# EAGLE design NZN Breakout (EAGLE 7.5.0)
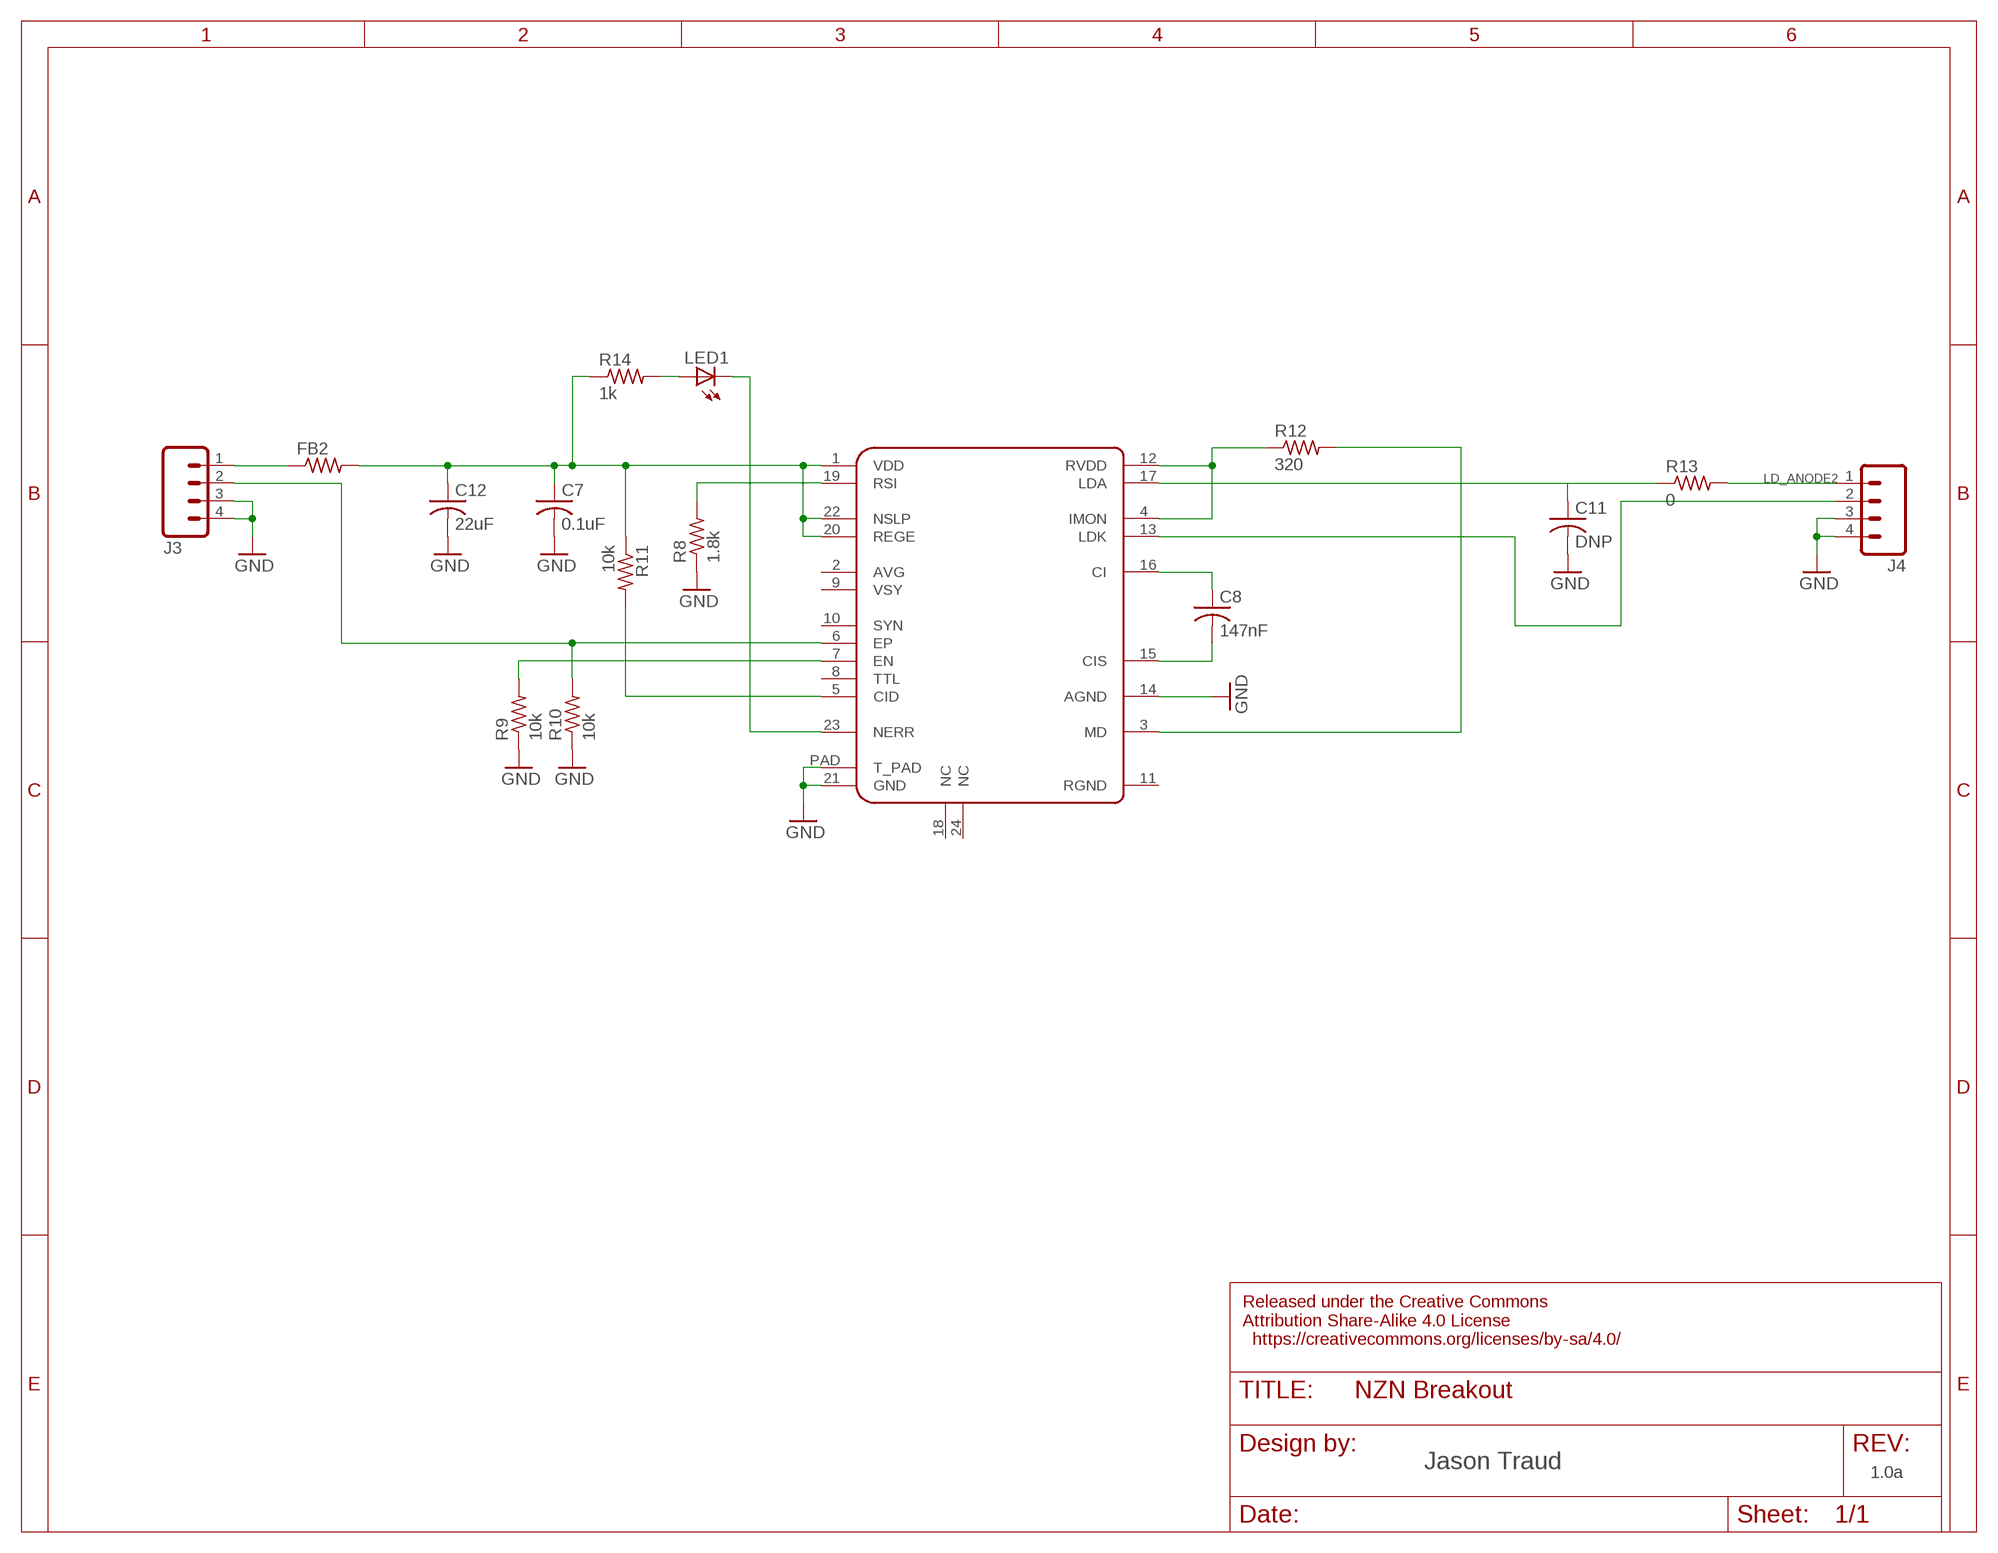
[diagram p0: schematic, sheet 1]

## Parts
C7  0.1uF  C-USC0402  [C0402]
C8  147nF  C-USC0402  [C0402]
C11  DNP  C-USC0805  [C0805]
C12  22uF  C-USC1206  [C1206]
FB2  R-US_R0805  [R0805]
J3  2X2  [2X2_1.27MM]
J4  2X2  [2X2_1.27MM]
LED1  LEDSML0805  [SML0805]
R8  1.8k  R-US_R0402  [R0402]
R9  10k  R-US_R0402  [R0402]
R10  10k  R-US_R0402  [R0402]
R11  10k  R-US_R0402  [R0402]
R12  320  R-US_R0402  [R0402]
R13  0  R-US_R0805  [R0805]
R14  1k  R-US_R0402  [R0402]
U$1  IC-NZN  [QFN24_PAD]

## Nets
ENABLE_2: J3.2 R10.2 U$1.6(EP)
GND: C7.2 C11.2 C12.2 J3.3 J3.4 J4.3 J4.4 R8.1 R9.1 R10.1 U$1.14(AGND) U$1.21(GND) U$1.PAD(T_PAD)
LD_ANODE2: J4.1 R13.2
N$13: C8.1 U$1.16(CI)
N$14: R8.2 U$1.19(RSI)
N$15: R11.2 U$1.5(CID)
N$16: LED1.C U$1.23(NERR)
N$17: J4.2 U$1.13(LDK)
N$18: C8.2 U$1.15(CIS)
N$20: R12.1 U$1.4(IMON) U$1.12(RVDD)
N$21: R12.2 U$1.3(MD)
N$22: C11.1 R13.1 U$1.17(LDA)
N$23: FB2.1 J3.1
N$24: LED1.A R14.2
N_ENABLE_2: R9.2 U$1.7(EN)
VIN2: C7.1 C12.1 FB2.2 R11.1 R14.1 U$1.1(VDD) U$1.20(REGE) U$1.22(NSLP)
Unconnected: U$1.2(AVG) U$1.8(TTL) U$1.9(VSY) U$1.10(SYN) U$1.11(RGND) U$1.18(NC) U$1.24(NC)

## Notes on the sheet
- Jason Traud
- 1.0a

## Library data of the parts
C7 C8 C11 = rcl:C-US: CAPACITOR, American symbol
C12 = rcl:C-US: CAPACITOR, American symbol; MFG_PN: TCTAL1C226M8R
FB2 = rcl:R-US_: RESISTOR, American symbol; MFG_PN: MPZ2012S300A
J3 J4 = TES-Connectors:2X2
LED1 = led:LED: LED OSRAM: - CHIPLED LG R971, LG N971, LY N971, LG Q971, LY Q971, LO R971, LY R971 LH N974, LH R974 LS Q976, LO Q976, LY Q976 LO Q996 - Hyper CHIPLED LW Q18S LB Q993, LB Q99A, LB R99A - SideLED LS A670, LO A670, LY A670, LG A670, LP A670 LB A673, LV A673, LT A673, LW A673 LH A674 LY A675 LS A676, LA A676, LO A676, LY A676, LW A676 LS A679, LY A679, LG A679 - Hyper Micro SIDELED® LS Y876, LA Y876, LO Y876, LY Y876 LT Y87S - SmartLED LW L88C, LW L88S LB L89C, LB L89S, LG L890 LS L89K, LO L89K, LY L89K LS L896, LA L896, LO L896, LY L896 - TOPLED LS T670, LO T670, LY T670, LG T670, LP T670 LSG T670, LSP T670, LSY T670, LOP T670, LYG T670 LG T671, LOG T671, LSG T671 LB T673, LV T673, LT T673, LW T673 LH T674 LS T676, LA T676, LO T676, LY T676, LB T676, LH T676, LSB T676, LW T676 LB T67C, LV T67C, LT T67C, LS T67K, LO T67K, LY T67K, LW E67C LS E67B, LA E67B, LO E67B, LY E67B, LB E67C, LV E67C, LT E67C LW T67C LS T679, LY T679, LG T679 LS T770, LO T770, LY T770, LG T770, LP T770 LB T773, LV T773, LT T773, LW T773 LH T774 LS E675, LA E675, LY E675, LS T675 LS T776, LA T776, LO T776, LY T776, LB T776 LHGB T686 LT T68C, LB T68C - Hyper Mini TOPLED® LB M676 - Mini TOPLED Santana® LG M470 LS M47K, LO M47K, LY M47K Source: http://www.osram.convergy.de LUXEON: - LUMILED® LXK2-PW12-R00, LXK2-PW12-S00, LXK2-PW14-U00, LXK2-PW14-V00 LXK2-PM12-R00, LXK2-PM12-S00, LXK2-PM14-U00 LXK2-PE12-Q00, LXK2-PE12-R00, LXK2-PE12-S00, LXK2-PE14-T00, LXK2-PE14-U00 LXK2-PB12-K00, LXK2-PB12-L00, LXK2-PB12-M00, LXK2-PB14-N00, LXK2-PB14-P00, LXK2-PB14-Q00 LXK2-PR12-L00, LXK2-PR12-M00, LXK2-PR14-Q00, LXK2-PR14-R00 LXK2-PD12-Q00, LXK2-PD12-R00, LXK2-PD12-S00 LXK2-PH12-R00, LXK2-PH12-S00 LXK2-PL12-P00, LXK2-PL12-Q00, LXK2-PL12-R00 Source: www.luxeon.com KINGBRIGHT: KA-3528ASYC Source: www.kingbright.com
R8-R14 = rcl:R-US_: RESISTOR, American symbol
U$1 = TES-DigitalIC:IC-NZN

## Board
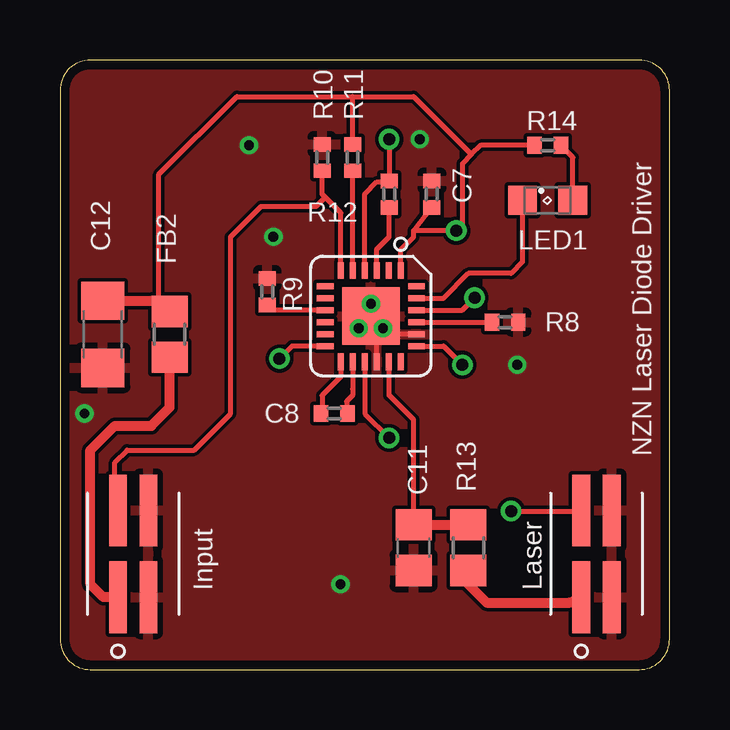
[diagram p1: board, top side]
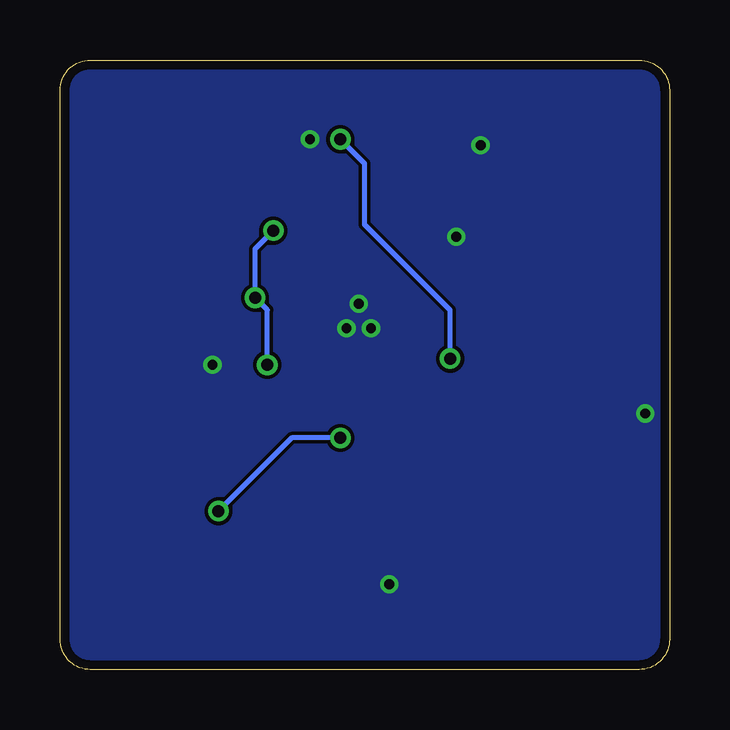
[diagram p2: board, bottom side, seen from below]

Size 25.4 x 25.4 mm. Coordinates in mm from the lower left corner, seen from the top.
Outline: 24.13,25.4 1.27,25.4 arc90 0,24.13 0,1.27 arc90 1.27,0 24.13,0 arc90 25.4,1.27 25.4,24.13 arc90 24.13,25.4
Copper layers (1*16): Top 0.0356mm / dielectric 1.5011mm / Bottom 0.0356mm
Design rules "LaenPCBOrder": minimum track width 6mil, minimum drill 13mil, track to track 6mil, track to pad 6mil, pad to pad 6mil, via to via 6mil, smd to smd 6mil, copper to edge 15mil, drill to drill 6mil, minimum pad ring 7mil, minimum via ring 7mil, stop-mask expansion 4mil, vias tented up to drill 0mil, thermal gap 10mil

### Footprints (pad centres in the part's own frame; a part is rotated, then mirrored left to right if it is on the bottom)
C0402 = smd 0.6 x 0.7: 1 -0.55,0; 2 0.55,0
C0805 = smd 1.3 x 1.5: 1 -0.95,0; 2 0.95,0
C1206 = smd 1.6 x 1.8: 1 -1.4,0; 2 1.4,0
R0805 = smd 1.3 x 1.5: 1 -0.95,0; 2 0.95,0
2X2_1.27MM = smd 0.737 x 2.997: 1 -0.635,-1.803; 2 -0.635,1.803; 3 0.635,-1.803; 4 0.635,1.803
SML0805 = smd 1.2 x 1.2: A 1.05,0; C -1.05,0
R0402 = smd 0.6 x 0.7: 1 -0.55,0; 2 0.55,0
QFN24_PAD = smd 0.7 x 0.25: 1 -1.9,1.25; 2 -1.9,0.75; 3 -1.9,0.25; 4 -1.9,-0.25; 5 -1.9,-0.75; 6 -1.9,-1.25; 13 1.9,-0.25; 14 1.9,0.25; 15 1.9,-0.75; 16 1.9,-1.25; 17 1.9,0.75; 18 1.9,1.25 | smd 0.25 x 0.7: 7 -0.25,-1.9; 8 0.25,-1.9; 9 -0.75,-1.9; 10 -1.25,-1.9; 11 0.75,-1.9; 12 1.25,-1.9; 19 0.25,1.9; 20 -0.25,1.9; 21 0.75,1.9; 22 1.25,1.9; 23 -0.75,1.9; 24 -1.25,1.9 | smd 2.4 x 2.4: PAD 0,0

### Placement (x,y rotation side)
C7  15.49,19.81 90 top
C8  11.43,10.67 0 top
C11  14.73,5.08 270 top
C12  1.78,13.97 270 top
FB2  4.57,13.97 90 top
J3  3.05,4.83 0 top
J4  22.35,4.83 0 top
LED1  20.32,19.56 0 top
R8  18.54,14.48 180 top
R9  8.64,15.75 270 top
R10  10.92,21.34 270 top
R11  12.19,21.34 270 top
R12  13.72,19.81 270 top
R13  17.02,5.08 270 top
R14  20.32,21.84 0 top
U$1  12.95,14.73 270 top

### Tracks (layer width: path | path; a pad name or v marks a point on that pad's centre or on a via)
ENABLE_2
  Top 0.203: U$1.6 11.7,19.03 11.05,19.68 | 11.05,19.68 10.92,19.81 R10.2 | J3.2 2.29,6.63 2.29,8.64 2.79,9.14 5.59,9.14 7.11,10.67 7.11,18.03 8.38,19.3 10.67,19.3 11.05,19.68
GND  (via drill 0.41)
  Top 0.203: U$1.21 13.7,13.98 v12.95,15.24 13.2,14.48 U$1.14
  other vias: 7.87,21.84 14.99,22.1 8.89,18.03 19.05,12.7 11.68,3.56 1.02,10.67 12.45,14.22 13.46,14.22
  pour Bottom: 24.13,25.4 1.27,25.4 arc90 0,24.13 0,1.27 arc90 1.27,0 24.13,0 arc90 25.4,1.27 25.4,24.13 arc90
  pour Top: 24.13,25.4 1.27,25.4 arc90 0,24.13 0,1.27 arc90 1.27,0 24.13,0 arc90 25.4,1.27 25.4,24.13 arc90
LD_ANODE2
  Top 0.406: R13.2 17.02,3.56 17.78,2.79 21.23,2.79 J4.1
N$13
  Top 0.203: U$1.16 11.7,12.21 10.92,11.43 10.92,10.71 C8.1
N$14
  Top 0.203: U$1.19 R8.2
N$15
  Top 0.203: U$1.5 12.2,20.77 R11.2
N$16
  Top 0.203: U$1.23 15.99,15.48 17.02,16.51 18.8,16.51 19.27,16.98 LED1.C
N$17  (via drill 0.5)
  Top 0.203: U$1.13 12.7,10.66 v13.72,9.65 | v18.8,6.6 21.44,6.6 J4.2
  Bottom 0.203: v13.72,9.65 15.75,9.65 v18.8,6.6
N$18
  Top 0.203: U$1.15 12.2,11.7 12.19,11.68 12.19,11.43 11.94,11.18 11.94,10.71 C8.2
N$20  (via drill 0.5)
  Top 0.203: U$1.4 12.7,19.82 13.21,20.32 13.67,20.32 R12.1 v13.72,22.1 | U$1.12 9.67,13.48 v9.14,12.95
  Bottom 0.203: v9.14,12.95 9.14,14.98 12.7,18.54 12.7,21.09 v13.72,22.1
N$21
  Top 0.203: U$1.3 13.2,17.52 13.72,18.03 R12.2
N$22
  Top 0.203: C11.1 14.73,10.41 13.72,11.43 13.72,12.82 U$1.17
  Top 0.406: C11.1 R13.1
N$23
  Top 0.406: J3.1 1.8,3.02 1.27,3.56 1.27,9.14 2.29,10.16 3.81,10.16 4.57,10.92 FB2.1
N$24
  Top 0.203: LED1.A 21.37,21.34 R14.2
N_ENABLE_2
  Top 0.203: U$1.7 8.43,14.98 R9.2
VIN2  (via drill 0.5)
  Top 0.203: U$1.1 14.2,17.51 14.73,18.03 14.73,18.29 | 14.73,18.29 C7.1 | U$1.20 16.76,14.98 v17.27,15.49 | 14.73,18.29 v16.51,18.29 16.76,18.54 16.76,21.08 17.14,21.46 | U$1.22 15.98,13.48 v16.76,12.7 | R14.1 17.53,21.84 17.14,21.46 | 4.12,15.37 4.12,20.63 7.37,23.88 12.19,23.88 | 12.19,23.88 14.73,23.88 17.14,21.46 | R11.1 12.19,23.88
  Top 0.406: C12.1 4.12,15.37 FB2.2
  Bottom 0.203: v16.51,18.29 17.27,17.53 v17.27,15.49 16.76,14.99 v16.76,12.7

### Text on the board
tPlace: NZN Laser Diode Driver | Input | Laser